# Altium schematic sheet Sheet1.SchDoc
size A3; SheetNumber: 1; SheetTotal: 1
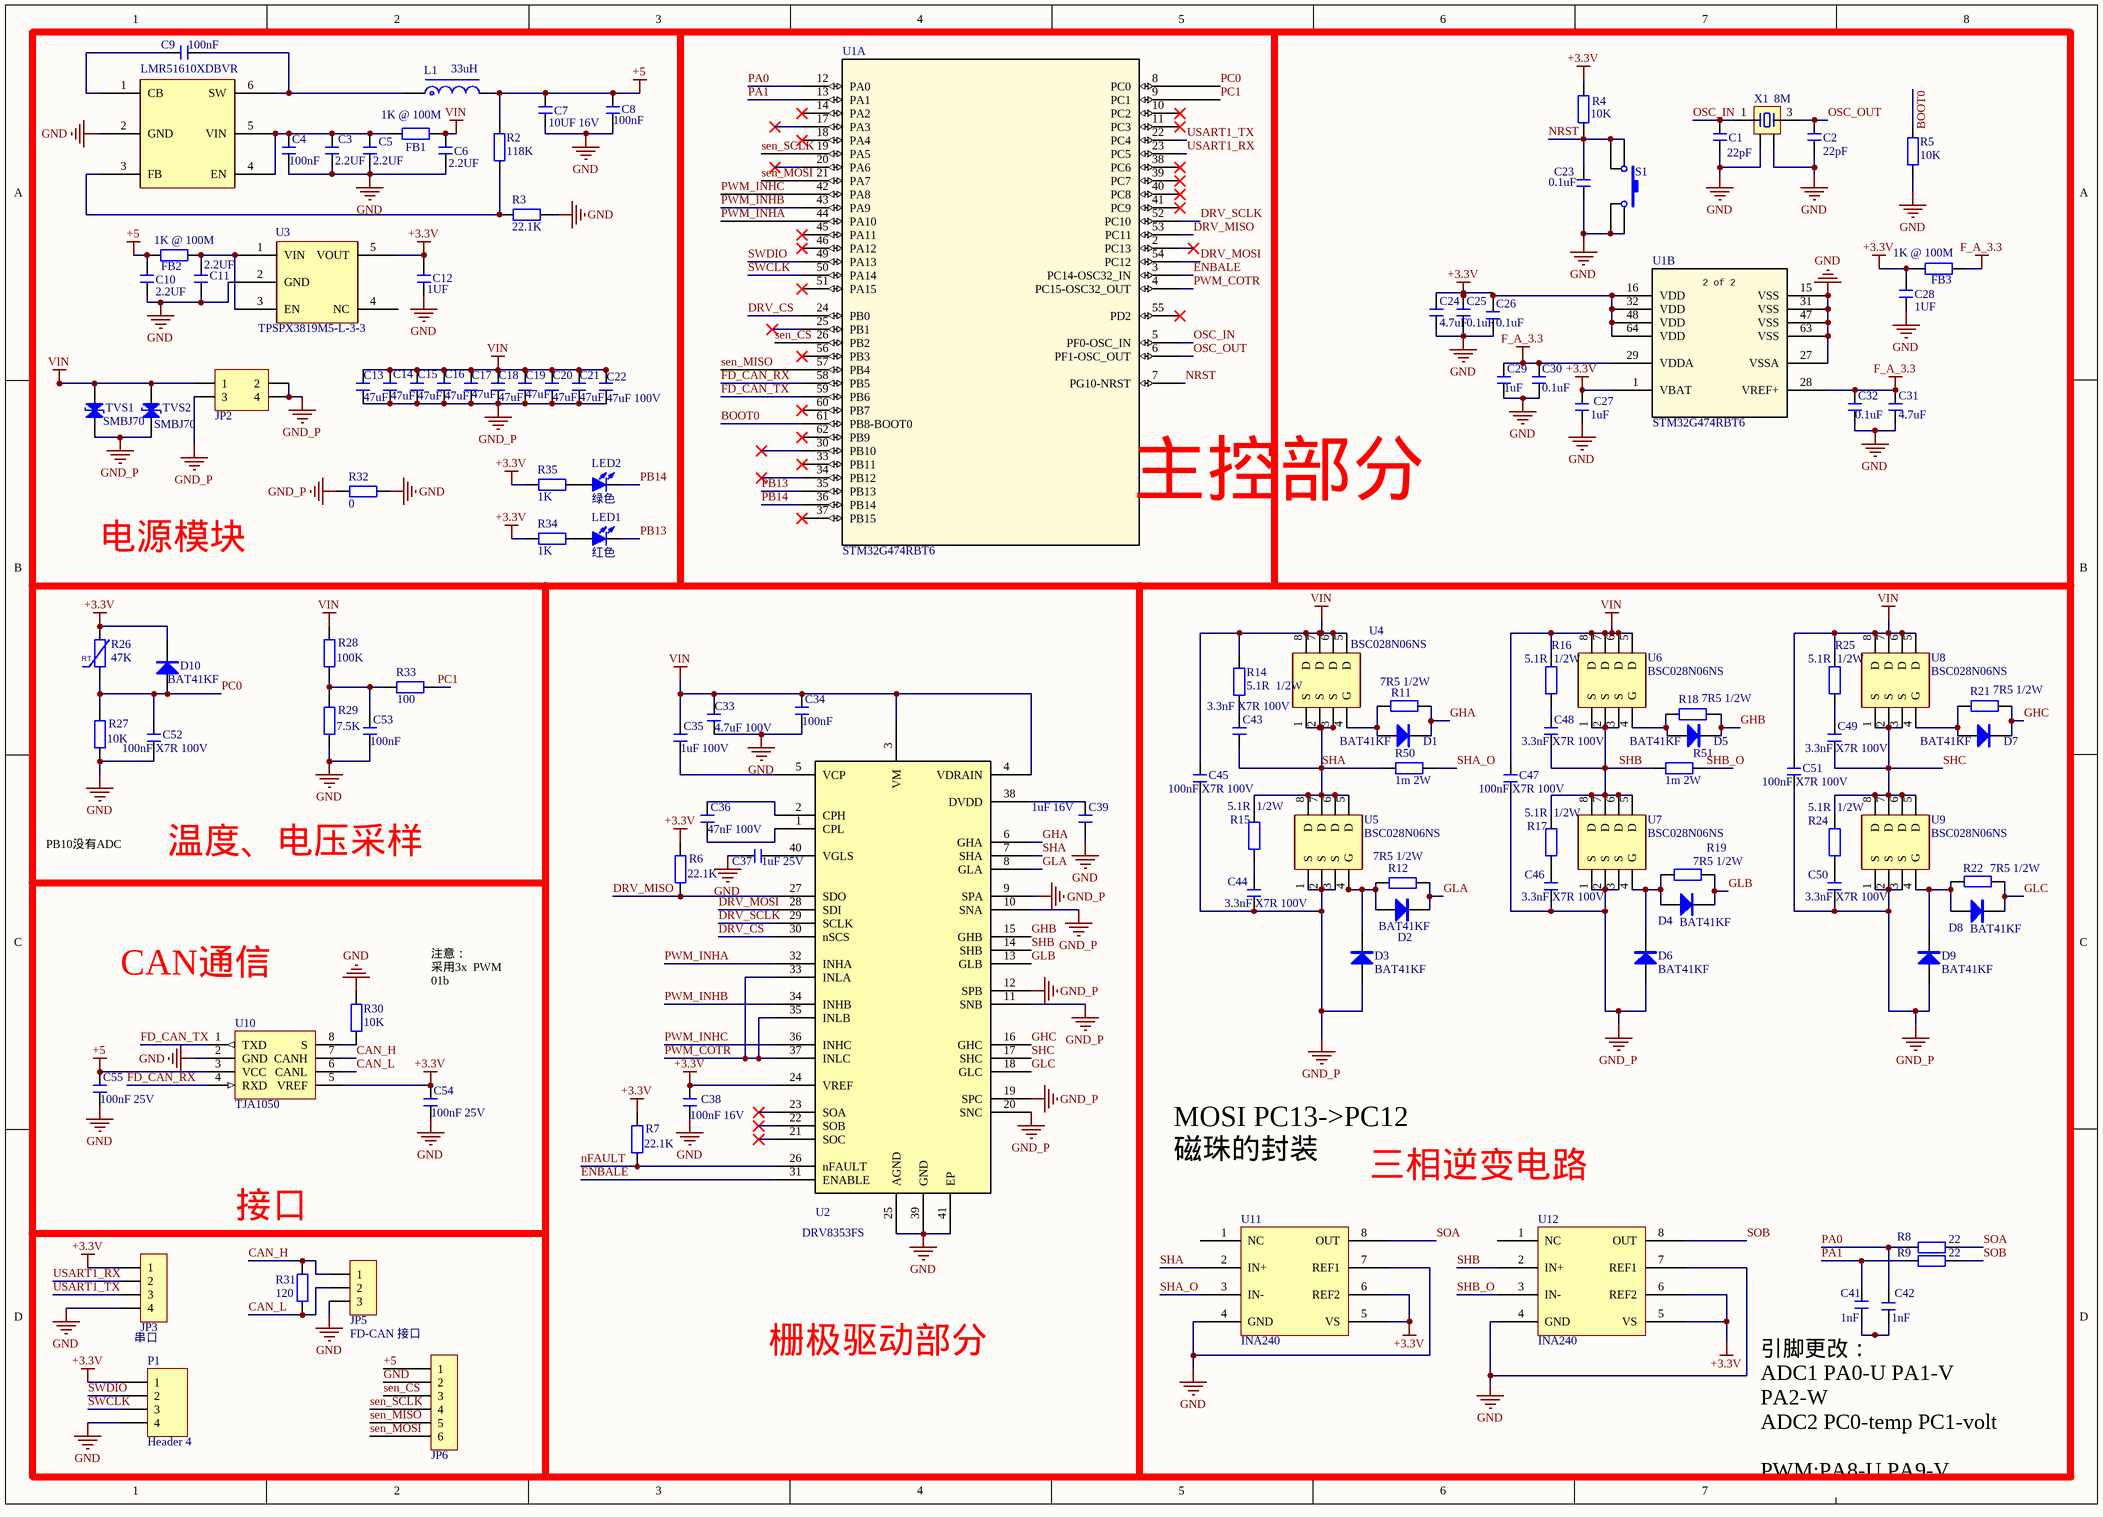
[diagram p0: Sheet1.SchDoc]

## Parts
C1  22pF  [C0402_L]
C2  22pF  [C0402_L]
C3  2.2UF  [C0603_L]
C4  100nF  [C0603_L]
C5  2.2UF  [C0603_L]
C6  2.2UF  [C0603_L]
C7  10UF 16V  [C0402_L]
C8  100nF  [C0402_L]
C9  100nF  [C0603_L]
C10  2.2UF  [C0402_L]
C11  2.2UF  [C0402_L]
C12  1UF  [C0402_L]
C13  47uF  [C1206_L]
C14  47uF  [C1206_L]
C15  47uF  [C1206_L]
C16  47uF  [C1206_L]
C17  47uF  [C1206_L]
C18  47uF  [C1206_L]
C19  47uF  [C1206_L]
C20  47uF  [C1206_L]
C21  47uF  [C1206_L]
C22  47uF 100V  [C1206_L]
C23  0.1uF  [C0402_L]
C24  4.7uF  [C0402_L]
C25  0.1uF  [C0402_L]
C26  0.1uF  [C0402_L]
C27  1uF  [C0402_L]
C28  1UF  [C0402_L]
C29  1uF  [C0402_L]
C30  0.1uF  [C0402_L]
C31  4.7uF  [C0402_L]
C32  0.1uF  [C0402_L]
C33  4.7uF 100V  [C0603_L]
C34  100nF  [C0603_L]
C35  1uF 100V  [C0603_L]
C36  47nF 100V  [C0603_L]
C37  1uF 25V  [C0603_L]
C38  100nF 16V  [C0402_L]
C39  1uF 16V  [C0603_L]
C41  1nF  [C0402_L]
C42  1nF  [C0402_L]
C43  3.3nF X7R 100V  [C1206_L]
C44  3.3nF X7R 100V  [C1206_L]
C45  100nF X7R 100V  [C0603_L]
C46  3.3nF X7R 100V  [C1206_L]
C47  100nF X7R 100V  [C0603_L]
C48  3.3nF X7R 100V  [C1206_L]
C49  3.3nF X7R 100V  [C1206_L]
C50  3.3nF X7R 100V  [C1206_L]
C51  100nF X7R 100V  [C0603_L]
C52  100nF X7R 100V  [C0603_L]
C53  100nF  [C0402_L]
C54  100nF 25V  [C0402_L]
C55  100nF 25V  [C0402_L]
D1  BAT41KF  [SOD-523]
D2  BAT41KF  [SOD-523]
D3  BAT41KF  [SOD-523]
D4  BAT41KF  [SOD-523]
D5  BAT41KF  [SOD-523]
D6  BAT41KF  [SOD-523]
D7  BAT41KF  [SOD-523]
D8  BAT41KF  [SOD-523]
D9  BAT41KF  [SOD-523]
D10  BAT41KF  [SOD-523]
FB1  1K @ 100M  [R1206_L]
FB2  1K @ 100M  [R1206_L]
FB3  1K @ 100M  [R0805_L]
JP2  Header2X2  [TX60PW-M20]  (value not drawn)
JP3  串口  [MX 1.25-WI-4P]
JP5  FD-CAN 接口  [XH2.54-WI-3P]
JP6  HDR-1X6  [MX 1.25-WI-6P]  (value not drawn)
L1  33uH  [NR4030]
LED1  红色  [LED0603_R]
LED2  绿色  [LED0603_R]
LMR51610XDBVR  Component_1  [SOT23-6M]  (value not drawn)
P1  Header 4  [HDR1X4]
R2  118K  [R0402_L]
R3  22.1K  [R0402_L]
R4  10K  [R0402_L]
R5  10K  [R0402_L]
R6  22.1K  [R0402_L]
R7  22.1K  [R0402_L]
R8  22  [R0402_L]
R9  22  [R0402_L]
R11  7R5 1/2W  [R1210_M]
R12  7R5 1/2W  [R1210_M]
R14  5.1R  1/2W  [R1210_L]
R15  5.1R  1/2W  [R1210_L]
R16  5.1R  1/2W  [R1210_L]
R17  5.1R  1/2W  [R1210_L]
R18  7R5 1/2W  [R1210_M]
R19  7R5 1/2W  [R1210_M]
R21  7R5 1/2W  [R1210_M]
R22  7R5 1/2W  [R1210_M]
R24  5.1R  1/2W  [R1210_L]
R25  5.1R  1/2W  [R1210_L]
R26  47K  [R0402-HP_L]
R27  10K  [R0402_L]
R28  100K  [R0402_L]
R29  7.5K  [R0402_L]
R30  10K  [R0402_L]
R31  120  [R0402_L]
R32  0  [R1206_L]
R33  100  [R0402_L]
R34  1K  [R0402_L]
R35  1K  [R0402_L]
R50  1m 2W  [R2512_M]
R51  1m 2W  [R2512_M]
S1  SW-PB4  [SW SMD-4*4*1.5]  (value not drawn)
TVS1  SMBJ70  [SMB]
TVS2  SMBJ70  [SMB]
U1  STM32G474RBT6  [FOC_LQFP64-10x10mm]  (parts A,B of 2)
U2  DRV8353FS  [QFN40 6X6_M]
U3  TPSPX3819M5-L-3-3  [SOT23-5]
U4  BSC028N06NS  [PG-TDSON-8_L5.0-W6.0-P1.27-LS6.2-BL-EP]
U5  BSC028N06NS  [PG-TDSON-8_L5.0-W6.0-P1.27-LS6.2-BL-EP]
U6  BSC028N06NS  [PG-TDSON-8_L5.0-W6.0-P1.27-LS6.2-BL-EP]
U7  BSC028N06NS  [PG-TDSON-8_L5.0-W6.0-P1.27-LS6.2-BL-EP]
U8  BSC028N06NS  [PG-TDSON-8_L5.0-W6.0-P1.27-LS6.2-BL-EP]
U9  BSC028N06NS  [PG-TDSON-8_L5.0-W6.0-P1.27-LS6.2-BL-EP]
U10  TJA1050  [VSON-8]
U11  INA240  [TSSOP8]
U12  INA240  [TSSOP8]
X1  8M  [OSC 3225-4P]

## Nets
+3.3V: C12.2 C24.2 C25.2 C26.2 C27.2 C28.2 C38.2 C54.2 D10.2(K) FB3.1 JP3.1 P1.1 R4.2 R6.2 R7.2 R26.2 R34.2 R35.2 U1.1(VBAT) U1.16(VDD) U1.32(VDD) U1.48(VDD) U1.64(VDD) U2.24(VREF) U3.5(VOUT) U10.5(VREF) U11.5(VS) U11.6(REF2) U12.5(VS) U12.6(REF2)
+5: C7.2 C8.2 C10.2 C55.2 FB2.1 JP6.1 L1.2 R2.2 U10.3(VCC)
F_A_3.3: C29.2 C30.2 C31.2 C32.2 FB3.2 U1.28(VREF+) U1.29(VDDA)
GND: C1.1 C2.1 C3.1 C4.1 C5.1 C6.1 C7.1 C8.1 C10.1 C11.1 C12.1 C23.1 C24.1 C25.1 C26.1 C27.1 C28.1 C29.1 C30.1 C31.1 C32.1 C33.1 C34.1 C37.1 C38.1 C39.1 C41.1 C42.1 C52.1 C53.1 C54.1 C55.1 JP3.4 JP5.3 JP6.2 LMR51610XDBVR.2(GND) P1.4 R3.1 R5.1 R27.1 R29.1 R30.1 R32.2 S1.2 S1.3 U1.15(VSS) U1.27(VSSA) U1.31(VSS) U1.47(VSS) U1.63(VSS) U2.25(AGND) U2.39(GND) U2.41(EP) U3.2(GND) U10.2(GND) U11.4(GND) U11.7(REF1) U12.4(GND) U12.7(REF1) X1.2 X1.4
GND_P: C13.1 C14.1 C15.1 C16.1 C17.1 C18.1 C19.1 C20.1 C21.1 C22.1 C44.1 C45.1 C46.1 C47.1 C50.1 C51.1 D3.1(A) D6.1(A) D9.1(A) JP2.2 JP2.3 JP2.4 R32.1 TVS1.2(K) TVS2.2(K) U2.9(SPA) U2.10(SNA) U2.11(SNB) U2.12(SPB) U2.19(SPC) U2.20(SNC) U5.1(S) U5.2(S) U5.3(S) U7.1(S) U7.2(S) U7.3(S) U9.1(S) U9.2(S) U9.3(S)
VIN: C6.2 C13.2 C14.2 C15.2 C16.2 C17.2 C18.2 C19.2 C20.2 C21.2 C22.2 C33.2 C34.2 C35.2 C45.2 C47.2 C51.2 FB1.2 JP2.1 R14.2 R16.2 R25.2 R28.2 TVS1.1(A) TVS2.1(A) U2.3(VM) U2.4(VDRAIN) U4.5(D) U4.6(D) U4.7(D) U4.8(D) U6.5(D) U6.6(D) U6.7(D) U6.8(D) U8.5(D) U8.6(D) U8.7(D) U8.8(D)
BOOT0: R5.2 U1.61(PB8-BOOT0)
CAN_H: JP5.1 R31.1 U10.7(CANH)
CAN_L: JP5.2 R31.2 U10.6(CANL)
DRV_CS: U1.24(PB0) U2.30(nSCS)
DRV_MISO: R6.1 U1.53(PC11) U2.27(SDO)
DRV_MOSI: U1.54(PC12) U2.28(SDI)
DRV_SCLK: U1.52(PC10) U2.29(SCLK)
ENBALE: U1.3(PC14-OSC32_IN) U2.31(ENABLE)
FD_CAN_RX: U1.58(PB5) U10.4(RXD)
FD_CAN_TX: U1.59(PB6) U10.1(TXD)
GHA: D1.2(K) R11.2 U2.6(GHA)
GHB: D5.2(K) R18.2 U2.15(GHB)
GHC: D7.2(K) R21.2 U2.16(GHC)
GLA: D2.2(K) R12.2 U2.8(GLA)
GLB: D4.2(K) R19.2 U2.13(GLB)
GLC: D8.2(K) R22.2 U2.18(GLC)
nFAULT: R7.1 U2.26(nFAULT)
NRST: C23.2 R4.1 S1.1 S1.4 U1.7(PG10-NRST)
OSC_IN: C1.2 U1.5(PF0-OSC_IN) X1.1
OSC_OUT: C2.2 U1.6(PF1-OSC_OUT) X1.3
PA0: C42.2 R8.2 U1.12(PA0)
PA1: C41.2 R9.2 U1.13(PA1)
PB13: LED1.2(K) U1.35(PB13)
PB14: LED2.2(K) U1.36(PB14)
PC0: C52.2 D10.1(A) R26.1 R27.2 U1.8(PC0)
PC1: R33.1 U1.9(PC1)
PWM_COTR: U1.4(PC15-OSC32_OUT) U2.33(INLA) U2.35(INLB) U2.37(INLC)
PWM_INHA: U1.44(PA10) U2.32(INHA)
PWM_INHB: U1.43(PA9) U2.34(INHB)
PWM_INHC: U1.42(PA8) U2.36(INHC)
sen_CS: JP6.3 U1.26(PB2)
sen_MISO: JP6.5 U1.57(PB4)
sen_MOSI: JP6.6 U1.21(PA7)
sen_SCLK: JP6.4 U1.19(PA5)
SHA: C43.1 R15.2 R50.2 U2.7(SHA) U4.1(S) U4.2(S) U4.3(S) U5.5(D) U5.6(D) U5.7(D) U5.8(D) U11.2(IN+)
SHA_O: R50.1 U11.3(IN-)
SHB: C48.1 R17.2 R51.2 U2.14(SHB) U6.1(S) U6.2(S) U6.3(S) U7.5(D) U7.6(D) U7.7(D) U7.8(D) U12.2(IN+)
SHB_O: R51.1 U12.3(IN-)
SHC: C49.1 R24.2 U2.17(SHC) U8.1(S) U8.2(S) U8.3(S) U9.5(D) U9.6(D) U9.7(D) U9.8(D)
SOA: R8.1 U11.8(OUT)
SOB: R9.1 U12.8(OUT)
SWCLK: P1.3 U1.50(PA14)
SWDIO: P1.2 U1.49(PA13)
USART1_RX: JP3.2 U1.23(PC5)
USART1_TX: JP3.3 U1.22(PC4)
NetC3_2: C3.2 C4.2 C5.2 FB1.1 LMR51610XDBVR.4(EN) LMR51610XDBVR.5(VIN)
NetC9_1: C9.1 L1.1 LMR51610XDBVR.6(SW)
NetC9_2: C9.2 LMR51610XDBVR.1(CB)
NetC11_2: C11.2 FB2.2 U3.1(VIN) U3.3(EN)
NetC35_1: C35.1 U2.5(VCP)
NetC36_1: C36.1 U2.1(CPL)
NetC36_2: C36.2 U2.2(CPH)
NetC37_2: C37.2 U2.40(VGLS)
NetC39_2: C39.2 U2.38(DVDD)
NetC43_2: C43.2 R14.1
NetC44_2: C44.2 R15.1
NetC46_2: C46.2 R17.1
NetC48_2: C48.2 R16.1
NetC49_2: C49.2 R25.1
NetC50_2: C50.2 R24.1
NetC53_2: C53.2 R28.1 R29.2 R33.2
NetD1_1: D1.1(A) R11.1 U4.4(G)
NetD2_1: D2.1(A) D3.2(K) R12.1 U5.4(G)
NetD4_1: D4.1(A) D6.2(K) R19.1 U7.4(G)
NetD5_1: D5.1(A) R18.1 U6.4(G)
NetD7_1: D7.1(A) R21.1 U8.4(G)
NetD8_1: D8.1(A) D9.2(K) R22.1 U9.4(G)
NetLED1_1: LED1.1(A) R34.1
NetLED2_1: LED2.1(A) R35.1
NetLMR51610XDBVR_3: LMR51610XDBVR.3(FB) R2.1 R3.2
NetR30_2: R30.2 U10.8(S)

Not connected (* = marked no-connect by the designer): U1 2(PC13)* 10(PC2)* 11(PC3)* 14(PA2)* 17(PA3)* 18(PA4)* 20(PA6)* 25(PB1)* 30(PB10)* 33(PB11)* 34(PB12)* 37(PB15)* 38(PC6)* 39(PC7)* 40(PC8)* 41(PC9)* 45(PA11)* 46(PA12)* 51(PA15)* 55(PD2)* 56(PB3)* 60(PB7)* 62(PB9)*; U2 21(SOC)* 22(SOB)* 23(SOA)*; U3 4(NC); U11 1(NC); U12 1(NC)

## Notes on the sheet
- (near U1) 主控部分
- 电源模块
- PB10没有ADC
- 温度、电压采样
- CAN通信
- 注意：
  采用3x  PWM
  01b
- MOSI PC13->PC12
  磁珠的封装
- 三相逆变电路
- 接口
- 栅极驱动部分
- 引脚更改：
  ADC1 PA0-U PA1-V PA2-W
  ADC2 PC0-temp PC1-volt
  PWM:PA8-U PA9-V PA10-W
- (in symbol STM32G474RBT6, part B) 2 of 2

## Library data of the parts
C1-C39 C41-C55 = C: 贴片电容; BOM名称: 无极性贴片电容; 淘宝ID: 封装库来自淘宝 ID：黄晶宝石; 联系售后，技术支持: https://shop463601444.taobao.com; 唯一出售店铺网址: https://shop463601444.taobao.com
D1-D10 = SR540: 肖特基二极管; BOM名称: 整流二极管; 版权归属: 封装库来自淘宝 ID：黄晶宝石; 属性: 40V  5A; 学习资源: https://item.taobao.com/item.htm?id=566775463719
FB1-FB3 R2-R9 R11 R12 R14-R19 R21 R22 R24 R25 R27-R35 R50 R51 = R: 贴片电阻; 版权归属: 来自淘宝 ID：黄晶宝石; 封装库来自淘宝卖家 ID：黄晶宝石: 其他店铺购入均为盗版，不享受售后技术支持服务，请立即申请退款; BOM名称: 贴片电阻; 联系售后: https://item.taobao.com/item.htm?id=566775463719
JP2 = Header 2X2: 2*2P接插件; 封装库来自淘宝卖家 ID：黄晶宝石: 最新版本发布https://item.taobao.com/item.htm?id=566775463719
JP3 = Header 4: 4P接插件; 联系售后: 封装库来自淘宝 ID：黄晶宝石; BOM名称: 4P接插件; 学习资源: https://shop463601444.taobao.com
JP5 = Header 3: 3P接插件; 版权归属: 封装库来自淘宝 ID：黄晶宝石; 学习资源: 最新版本发布https://item.taobao.com/item.htm?id=566775463719; BOM名称: 3P接插件
JP6 = Header 6: 6P接插件; 版权归属: 封装库来自淘宝 ID：黄晶宝石; BOM名称: 6P接插件; 学习资源: https://shop463601444.taobao.com
L1 = L-NR: NR磁胶电感; 版权归属: 来自淘宝 ID：黄晶宝石; BOM名称: NR磁胶电感; 联系售后: https://item.taobao.com/item.htm?id=566775463719
LED1 LED2 = LED-SMD: 贴片LED; 版权归属: 封装库来自淘宝 ID：黄晶宝石; BOM名称: 贴片LED; 学习资源: https://item.taobao.com/item.htm?id=566775463719
P1 = Header 4: Header, 4-Pin; LatestRevisionDate: 17-Jul-2002; LatestRevisionNote: Re-released for DXP Platform.; Publisher: Altium Limited
R26 = RT: 热敏电阻; BOM名称: 压敏电阻; 版权归属: 封装库来自淘宝 ID：黄晶宝石; 联系售后: https://item.taobao.com/item.htm?id=566775463719; 封装库来自淘宝卖家 ID：黄晶宝石: https://shop463601444.taobao.com
S1 = SW-PB4: 微动开关; Published: 24-Mar-1999; LatestRevisionDate: 17-Jul-2002; LatestRevisionNote: Re-released for DXP Platform.; PackageReference: SPST-2; Publisher: Altium Limited
TVS1 TVS2 = DR: 瞬态电压抑制二极管; 版权归属: 封装库来自淘宝 ID：黄晶宝石; BOM名称: 瞬态电压抑制二极管; 学习资源: https://item.taobao.com/item.htm?id=566775463719
U1 = STM32G474RBT6: No Description Available; Vendor: STMicroelectronics; Built_By: EMA_UL_Team; SourceLibrary: Updates_to_database_2020-10-19; Manufacturer_Part_Number: STM32G474RBT6; Copyright: Copyright (C) 2018 Accelerated Designs. All rights reserved; RefDes: RefDes; Type: DEV
U2 = DRV8353RS
U10 = TJA1050: CAN总线收发芯片; 学习资源: 最新版本发布https://item.taobao.com/item.htm?id=566775463719; 版权归属: 封装库来自淘宝 ID：黄晶宝石; BOM名称: CAN总线收发芯片
X1 = XTAL-4P: 4脚无源晶振; 版权归属: 封装库来自淘宝卖家 ID：黄晶宝石; BOM名称: 4脚无源晶振; 学习资源: https://shop463601444.taobao.com